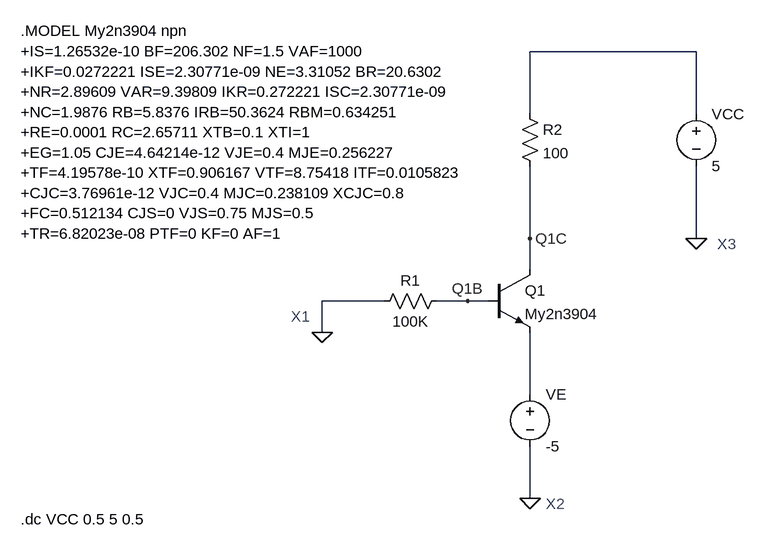
[diagram p0: schematic part1 schematic.asc]
part1 schematic.asc, the LTspice schematic file:
Version 4
SHEET 1 880 680
WIRE 688 -384 432 -384
WIRE 432 -288 432 -384
WIRE 688 -288 688 -384
WIRE 432 -96 432 -208
WIRE 688 -96 688 -208
WIRE 432 -48 432 -96
WIRE 208 0 112 0
WIRE 336 0 288 0
WIRE 368 0 336 0
WIRE 112 48 112 0
WIRE 432 144 432 48
WIRE 432 304 432 224
FLAG 112 48 0
FLAG 432 304 0
FLAG 688 -96 0
FLAG 336 0 Q1B
FLAG 432 -96 Q1C
SYMBOL res 304 -16 R90
WINDOW 0 0 56 VBottom 2
WINDOW 3 32 56 VTop 2
SYMATTR InstName R1
SYMATTR Value 100K
SYMBOL npn 368 -48 R0
SYMATTR InstName Q1
SYMATTR Value My2n3904
SYMBOL voltage 432 128 R0
WINDOW 123 0 0 Left 0
WINDOW 39 0 0 Left 0
SYMATTR InstName VE
SYMATTR Value -5
SYMBOL res 416 -304 R0
SYMATTR InstName R2
SYMATTR Value 100
SYMBOL voltage 688 -304 R0
WINDOW 123 0 0 Left 0
WINDOW 39 0 0 Left 0
SYMATTR InstName VCC
SYMATTR Value 5
TEXT 720 -88 Left 2 ;X3
TEXT 456 312 Left 2 ;X2
TEXT 64 24 Left 2 ;X1
TEXT -352 -416 Left 2 !.MODEL My2n3904 npn\n+IS=1.26532e-10 BF=206.302 NF=1.5 VAF=1000\n+IKF=0.0272221 ISE=2.30771e-09 NE=3.31052 BR=20.6302\n+NR=2.89609 VAR=9.39809 IKR=0.272221 ISC=2.30771e-09\n+NC=1.9876 RB=5.8376 IRB=50.3624 RBM=0.634251\n+RE=0.0001 RC=2.65711 XTB=0.1 XTI=1\n+EG=1.05 CJE=4.64214e-12 VJE=0.4 MJE=0.256227\n+TF=4.19578e-10 XTF=0.906167 VTF=8.75418 ITF=0.0105823\n+CJC=3.76961e-12 VJC=0.4 MJC=0.238109 XCJC=0.8\n+FC=0.512134 CJS=0 VJS=0.75 MJS=0.5\n+TR=6.82023e-08 PTF=0 KF=0 AF=1
TEXT -352 336 Left 2 !.dc VCC 0.5 5 0.5

The netlist it stands for:
* part1 schematic.asc
R1 Q1B 0 100K
Q1 Q1C Q1B N002 0 My2n3904
VE N002 0 -5
R2 N001 Q1C 100
VCC N001 0 5
.model NPN NPN
.model PNP PNP
.lib standard.bjt
* X3
* X2
* X1
.MODEL My2n3904 npn
+IS=1.26532e-10 BF=206.302 NF=1.5 VAF=1000
+IKF=0.0272221 ISE=2.30771e-09 NE=3.31052 BR=20.6302
+NR=2.89609 VAR=9.39809 IKR=0.272221 ISC=2.30771e-09
+NC=1.9876 RB=5.8376 IRB=50.3624 RBM=0.634251
+RE=0.0001 RC=2.65711 XTB=0.1 XTI=1
+EG=1.05 CJE=4.64214e-12 VJE=0.4 MJE=0.256227
+TF=4.19578e-10 XTF=0.906167 VTF=8.75418 ITF=0.0105823
+CJC=3.76961e-12 VJC=0.4 MJC=0.238109 XCJC=0.8
+FC=0.512134 CJS=0 VJS=0.75 MJS=0.5
+TR=6.82023e-08 PTF=0 KF=0 AF=1
.dc VCC 0.5 5 0.5
.backanno
.end